# Altium project PowerMeter.PrjPCB
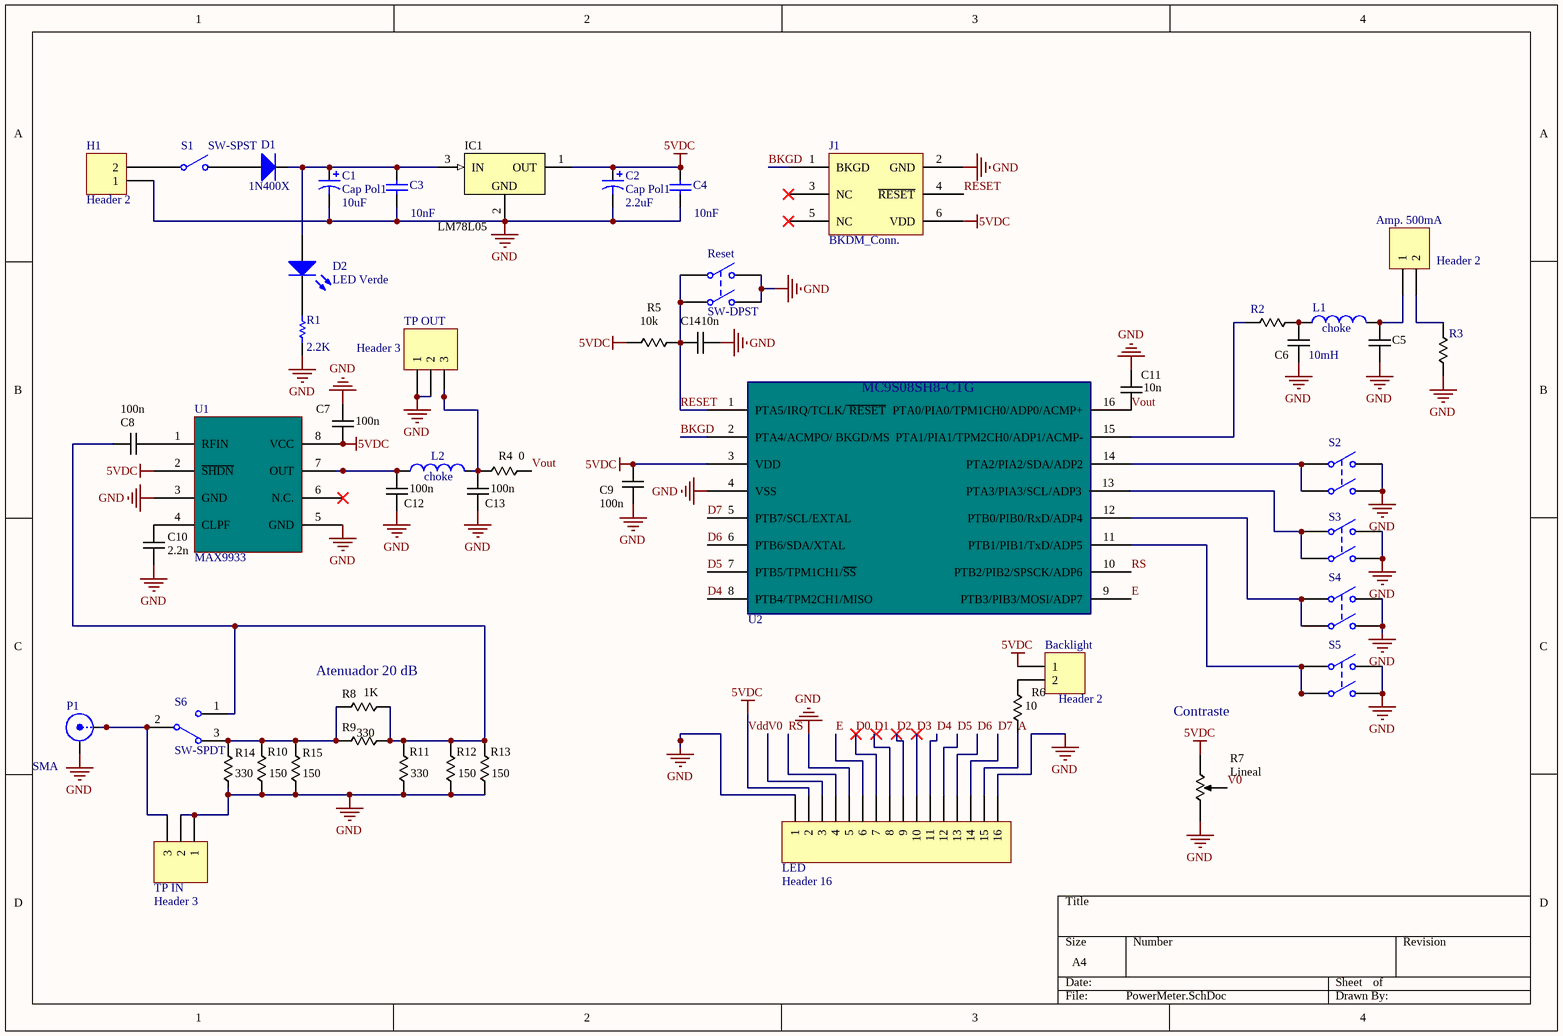
[diagram p0: PowerMeter.SchDoc]
2 sheets, 69 parts. Net scope: global (net labels, ports and power ports of the same name join across sheets).
Board files: PowerMeter.PcbDoc, PowerMeter-v2.PcbDoc
Sheets:
  PowerMeter.SchDoc
  PowerMeterV2.SchDoc

## Sheet PowerMeter.SchDoc
size A4

### Parts
Amp._500mA  Header 2  [HDR1X2]
Backlight  Header 2  [HDR1X2]
C1  Cap Pol1  value 10uF  [CAPPR2-5x11]
C2  Cap Pol1  value 2.2uF  [CAPPR2-5x11]
C3  value 10nF  [SMD generico]
C4  value 10nF  [SMD generico]
C5  Capacitor  [SMD Generico]  (value not drawn)
C6  Capacitor  [SMD Generico]  (value not drawn)
C7  Capacidad: 100n  [SMD Generico]  (hidden comment: Capacitor)
C8  Capacidad: 100n  [SMD Generico]  (hidden comment: Capacitor)
C9  Capacidad: 100n  [CAP-0805]  (hidden comment: Capacitor)
C10  Capacidad: 2.2n  [SMD Generico]  (hidden comment: Capacitor)
C11  Capacidad: 10n  [SMD Generico]  (hidden comment: Capacitor)
C12  Capacidad: 100n  [SMD Generico]  (hidden comment: Capacitor)
C13  Capacidad: 100n  [SMD Generico]  (hidden comment: Capacitor)
C14  Capacidad: 10n  [SMD Generico]  (hidden comment: Capacitor)
D1  1N400X  [MELF]
D2  LED Verde  [LED]
H1  Header 2  [HDR1X2]
IC1  Nombre: LM78L05  [TO-92 (2)]  (hidden comment: 78Lxx)
J1  BKDM_Conn.  [HDR2X3]
L1  choke  value 10mH  [axial-0.4]
L2  choke  [AXIAL-0.4]
LED  Header 16  [HDR1X16]
P1  SMA  [SMB_V-RJ45]
R1  value 2.2K  [SMD generico]
R2  Resistor  [SMD generico]  (value not drawn)
R3  Resistor  [smd generico]  (value not drawn)
R4  Resistencia: 0  [SMD GENERICO]  (hidden comment: Resistor)
R5  Resistencia: 10k  [smd generico]  (hidden comment: Resistor)
R6  Resistencia: 10  [SMD generico]  (hidden comment: Resistor)
R7  Variación: Lineal  [TRIMMER-H (5)]  (hidden comment: Potenciómetro)
R8  Resistencia: 1K  [SMD generico]  (hidden comment: Resistor)
R9  Resistencia: 330  [SMD generico]  (hidden comment: Resistor)
R10  Resistencia: 150  [SMD generico]  (hidden comment: Resistor)
R11  Resistencia: 330  [SMD generico]  (hidden comment: Resistor)
R12  Resistencia: 150  [SMD generico]  (hidden comment: Resistor)
R13  Resistencia: 150  [SMD generico]  (hidden comment: Resistor)
R14  Resistencia: 330  [SMD generico]  (hidden comment: Resistor)
R15  Resistencia: 150  [SMD generico]  (hidden comment: Resistor)
Reset  SW-DPST  [SW-T-V-6x6]
S1  SW-SPST  [SPST-2]
S2  SW-DPST  [SW-T-V-6x6]  (value not drawn)
S3  SW-DPST  [SW-T-V-6x6]  (value not drawn)
S4  SW-DPST  [SW-T-V-6x6]  (value not drawn)
S5  SW-DPST  [SW-T-V-6x6]  (value not drawn)
S6  SW-SPDT  [SW-SPDT-H]
TP_IN  Header 3  [HDR1X3]
TP_OUT  Header 3  [HDR1X3]
U1  MAX9933  [8L uMAX]
U2  MC9S08SH8  [TSSOP16]  (value not drawn)

### Nets
GND: C1.2 C2.2 C3.1 C4.1 C5.1 C6.1 C7.1 C9.1 C10.2 C11.2 C12.1 C13.1 C14.1 H1.1 IC1.2(GND) J1.2(GND) LED.1 LED.5 LED.16 P1.2(Y) R1.1 R3.1 R7.3 R10.1 R11.1 R12.1 R13.1 R14.1 R15.1 Reset.2(NO1) Reset.4(NO2) S2.2(NO1) S2.4(NO2) S3.2(NO1) S3.4(NO2) S4.2(NO1) S4.4(NO2) S5.2(NO1) S5.4(NO2) TP_IN.1 TP_IN.2 TP_OUT.1 TP_OUT.2 U1.3(GND) U1.5(GND) U2.4(VSS)
Vdd: Backlight.1 C2.1 C4.2 C7.2 C9.2 IC1.1(OUT) J1.6(VDD) LED.2 R5.2 R7.1 U1.2(~{SHDN}) U1.8(VCC) U2.3(VDD)  [also labelled 5VDC]
A: LED.15 R6.1
BKGD: J1.1(BKGD) U2.2(PTA4/ACMPO/_BKGD/MS)
D0: LED.7
D1: LED.8
D2: LED.9
D3: LED.10
D4: LED.11 U2.8(PTB4/TPM2CH1/MISO)
D5: LED.12 U2.7(PTB5/TPM1CH1/~{SS})
D6: LED.13 U2.6(PTB6/SDA/XTAL)
D7: LED.14 U2.5(PTB7/SCL/EXTAL)
E: LED.6 U2.9(PTB3/PIB3/MOSI/ADP7)
RESET: C14.2 J1.4(~{RESET}) R5.1 Reset.1(COMMON1) Reset.3(COMMON2) U2.1(PTA5/IRQ/TCLK/~{_RESET})
RS: LED.4 U2.10(PTB2/PIB2/SPSCK/ADP6)
V0: LED.3 R7.2(M)
Vout: C11.1 R4.2 U2.16(PTA0/PIA0/TPM1CH0/ADP0/ACMP+)
NetAmp._500mA_1: Amp._500mA.1 C5.2 L1.2
NetAmp._500mA_2: Amp._500mA.2 R3.2
NetBacklight_2: Backlight.2 R6.2
NetC1_1: C1.1 C3.2 D1.2(K) D2.1(A) IC1.3(IN)
NetC6_2: C6.2 L1.1 R2.1
NetC8_1: C8.1 U1.1(RFIN)
NetC8_2: C8.2 R8.1 R9.1 R11.2 R12.2 R13.2 S6.1
NetC10_1: C10.1 U1.4(CLPF)
NetC12_2: C12.2 L2.1 U1.7(OUT)
NetC13_2: C13.2 L2.2 R4.1 TP_OUT.3
NetD1_1: D1.1(A) S1.2(NO)
NetD2_2: D2.2(K) R1.2
NetH1_2: H1.2 S1.1(COMMON)
NetP1_1: P1.1(X) S6.2 TP_IN.3
NetR2_2: R2.2 U2.15(PTA1/PIA1/TPM2CH0/ADP1/ACMP-)
NetR8_2: R8.2 R9.2 R10.2 R14.2 R15.2 S6.3
NetS2_1: S2.1(COMMON1) S2.3(COMMON2) U2.14(PTA2/PIA2/SDA/ADP2)
NetS3_1: S3.1(COMMON1) S3.3(COMMON2) U2.13(PTA3/PIA3/SCL/ADP3)
NetS4_1: S4.1(COMMON1) S4.3(COMMON2) U2.12(PTB0/PIB0/RxD/ADP4)
NetS5_1: S5.1(COMMON1) S5.3(COMMON2) U2.11(PTB1/PIB1/TxD/ADP5)

Not connected (* = marked no-connect by the designer): J1 3(NC)* 5(NC)*; U1 6(N.C.)*

### Notes on the sheet
- (near R8) Atenuador 20 dB
- (near R7) Contraste
- (in symbol MC9S08SH8) MC9S08SH8-CTG

### Library data of the parts
Amp._500mA Backlight H1 = Header 2: Header, 2-Pin; LatestRevisionDate: 17-Jul-2002; LatestRevisionNote: Re-released for DXP Platform.; Publisher: Altium Limited
C1 C2 = Cap Pol1: Polarized Capacitor (Radial); Published: 8-Jun-2000; LatestRevisionDate: 17-Jul-2002; LatestRevisionNote: Re-released for DXP Platform.; PackageReference: RB7.6-15; Publisher: Altium Limited
C3 C4 = Cap: Capacitor; Published: 8-Jun-2000; LatestRevisionDate: 17-Jul-2002; LatestRevisionNote: Re-released for DXP Platform.; PackageReference: RAD-0.3; Publisher: Altium Limited
C5-C14 = Capacitor: Capacitor no polarizado
D1 = Diode: Default Diode; Published: 8-Jun-2000; LatestRevisionDate: 17-Jul-2002; LatestRevisionNote: Re-released for DXP Platform.; PackageVersion: Sep-1996; PackageReference: SMC; Publisher: Altium Limited; Code_JEDEC: DO-214-AB
D2 = LED0: Typical INFRARED GaAs LED; Published: 8-Jun-2000; LatestRevisionDate: 08-Jul-2005; LatestRevisionNote: Mech Layer 1 removed.; PackageReference: LED-0; Publisher: Altium Limited
IC1 = 78Lxx: Regulador fijo de tensión positiva 100mA
L1 L2 = Inductor: Code_IEC: 1005; Published: 8-Jun-2000; LatestRevisionDate: 29-May-2009; LatestRevisionNote: IPC-7351 Footprint Added.; PackageReference: 0402-A; Publisher: Altium Limited; PackageDescription: Chip Inductor; Code_JEITA: 0402
LED = Header 16: Header, 16-Pin; LatestRevisionDate: 17-Jul-2002; LatestRevisionNote: Re-released for DXP Platform.; Publisher: Altium Limited
P1 = SMB: SMB Straight Connector; LatestRevisionDate: 17-Jul-2002; LatestRevisionNote: Re-released for DXP Platform.; Publisher: Altium Limited
R1 = Res1: Resistor; Published: 8-Jun-2000; LatestRevisionDate: 17-Jul-2002; LatestRevisionNote: Re-released for DXP Platform.; PackageReference: AXIAL-0.3; Publisher: Altium Limited
Reset S2-S5 = SW-DPST: Double-Pole, Single-Throw Switch; pin to pad: 3>1 4>2; Published: 24-Mar-1999; LatestRevisionDate: 17-Jul-2002; LatestRevisionNote: Re-released for DXP Platform.; PackageReference: DPST-4; Publisher: Altium Limited
S1 = SW-SPST: Single-Pole, Single-Throw Switch; Published: 24-Mar-1999; LatestRevisionDate: 17-Jul-2002; LatestRevisionNote: Re-released for DXP Platform.; PackageReference: SPST-2; Publisher: Altium Limited
S6 = SW-SPDT: SPDT Subminiature Toggle Switch, Right Angle Mounting, Vertical Actuation; pin to pad: 1>2 2>1; Published: 24-Mar-1999; LatestRevisionDate: 17-Dec-2003; LatestRevisionNote: Schematic revised, PCB Footprint replaced.; DatasheetVersion: 05-Dec-2000; PackageReference: TL36WW15050; Publisher: Altium Limited; ComponentLink1Description: Manufacturer Link; ComponentLink1URL: http://www.apem.com
TP_IN TP_OUT = Header 3: Header, 3-Pin; LatestRevisionDate: 17-Jul-2002; LatestRevisionNote: Re-released for DXP Platform.; Publisher: Altium Limited
U1 = MAX9933: RF LOG DETECTOR; Name: MAX9933
U2 = MC9S08SH8: Microcontrolador

## Sheet PowerMeterV2.SchDoc
size A4
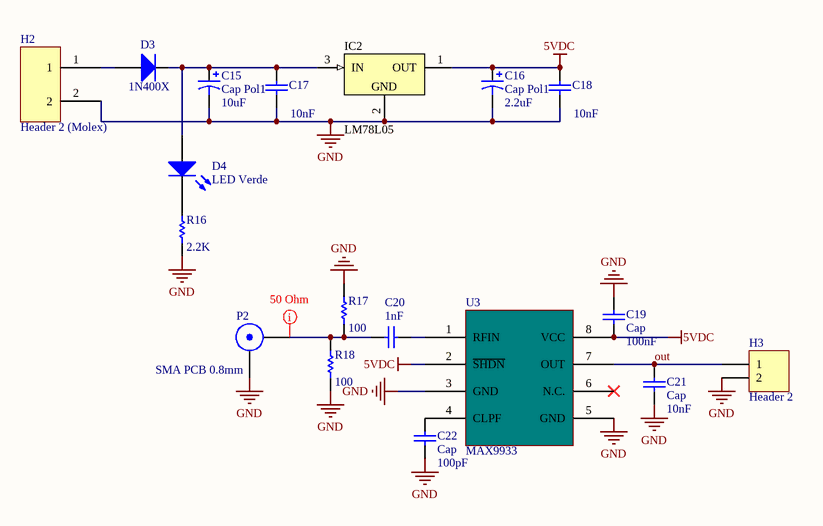
[diagram p1: PowerMeterV2.SchDoc]

### Parts
C15  Cap Pol1  value 10uF  [CAPPR2-5x11]
C16  Cap Pol1  value 2.2uF  [CAPPR2-5x11]
C17  value 10nF  [6-0805_L]
C18  value 10nF  [6-0805_L]
C19  Cap  value 100nF  [6-0805_L]
C20  value 1nF  [6-0805_L]
C21  Cap  value 10nF  [6-0805_L]
C22  Cap  value 100pF  [6-0805_L]
D3  1N400X  [MELF]
D4  LED Verde  [LED]
H2  Header 2 (Molex)  [Header 2 (Molex)]
H3  Header 2  [HDR1X2]
IC2  Nombre: LM78L05  [TO-92 (2)]  (hidden comment: 78Lxx)
P2  SMA PCB 0.8mm  [SMA PCB 0.8mm]
R16  value 2.2K  [6-0805_L]
R17  value 100  [6-0805_L]
R18  value 100  [6-0805_L]
U3  MAX9933  [8L uMAX]

### Nets
5VDC: C16.1 C18.2 C19.2 IC2.1(OUT) U3.2(~{SHDN}) U3.8(VCC)  [project net Vdd]
GND: C15.2 C16.2 C17.1 C18.1 C19.1 C21.2 C22.2 H2.2 H3.2 IC2.2(GND) P2.2(Y) R16.1 R17.2 R18.1 U3.3(GND) U3.5(GND)
out: C21.1 H3.1 U3.7(OUT)
NetC15_1: C15.1 C17.2 D3.2(K) D4.1(A) IC2.3(IN)
NetC20_1: C20.1 P2.1(X) R17.1 R18.2
NetC20_2: C20.2 U3.1(RFIN)
NetC22_1: C22.1 U3.4(CLPF)
NetD3_1: D3.1(A) H2.1
NetD4_2: D4.2(K) R16.2

Not connected (* = marked no-connect by the designer): U3 6(N.C.)*

### Layout directives
net class 50 Ohm: NetC20_1

### Library data of the parts
C15 C16 = Cap Pol1: Polarized Capacitor (Radial); Published: 8-Jun-2000; LatestRevisionDate: 17-Jul-2002; LatestRevisionNote: Re-released for DXP Platform.; PackageReference: RB7.6-15; Publisher: Altium Limited
C17-C22 = Cap: Capacitor; Published: 8-Jun-2000; LatestRevisionDate: 17-Jul-2002; LatestRevisionNote: Re-released for DXP Platform.; PackageReference: RAD-0.3; Publisher: Altium Limited
  C19-C22: PackageDescription: Radial Cap, Thru-Hole; 2 Leads; 0.3 in Pin Spacing
D3 = Diode: Default Diode; Published: 8-Jun-2000; LatestRevisionDate: 17-Jul-2002; LatestRevisionNote: Re-released for DXP Platform.; PackageVersion: Sep-1996; PackageReference: SMC; Publisher: Altium Limited; Code_JEDEC: DO-214-AB
D4 = LED0: Typical INFRARED GaAs LED; Published: 8-Jun-2000; LatestRevisionDate: 08-Jul-2005; LatestRevisionNote: Mech Layer 1 removed.; PackageReference: LED-0; Publisher: Altium Limited
H2 = Header 2 (Molex): 2-Pin Header with Lock (0_100in pitch)
H3 = Header 2: Header, 2-Pin; LatestRevisionDate: 17-Jul-2002; LatestRevisionNote: Re-released for DXP Platform.; Publisher: Altium Limited
IC2 = 78Lxx: Regulador fijo de tensión positiva 100mA
R16-R18 = Res1: Resistor; Published: 8-Jun-2000; LatestRevisionDate: 17-Jul-2002; LatestRevisionNote: Re-released for DXP Platform.; PackageReference: AXIAL-0.3; Publisher: Altium Limited
U3 = MAX9933: RF LOG DETECTOR

## Nets that join several sheets
GND: PowerMeter (46 pins), PowerMeterV2 (16 pins)
Vdd: PowerMeter (13 pins), PowerMeterV2 (6 pins)